# Altium project PCB_Project.PrjPcb
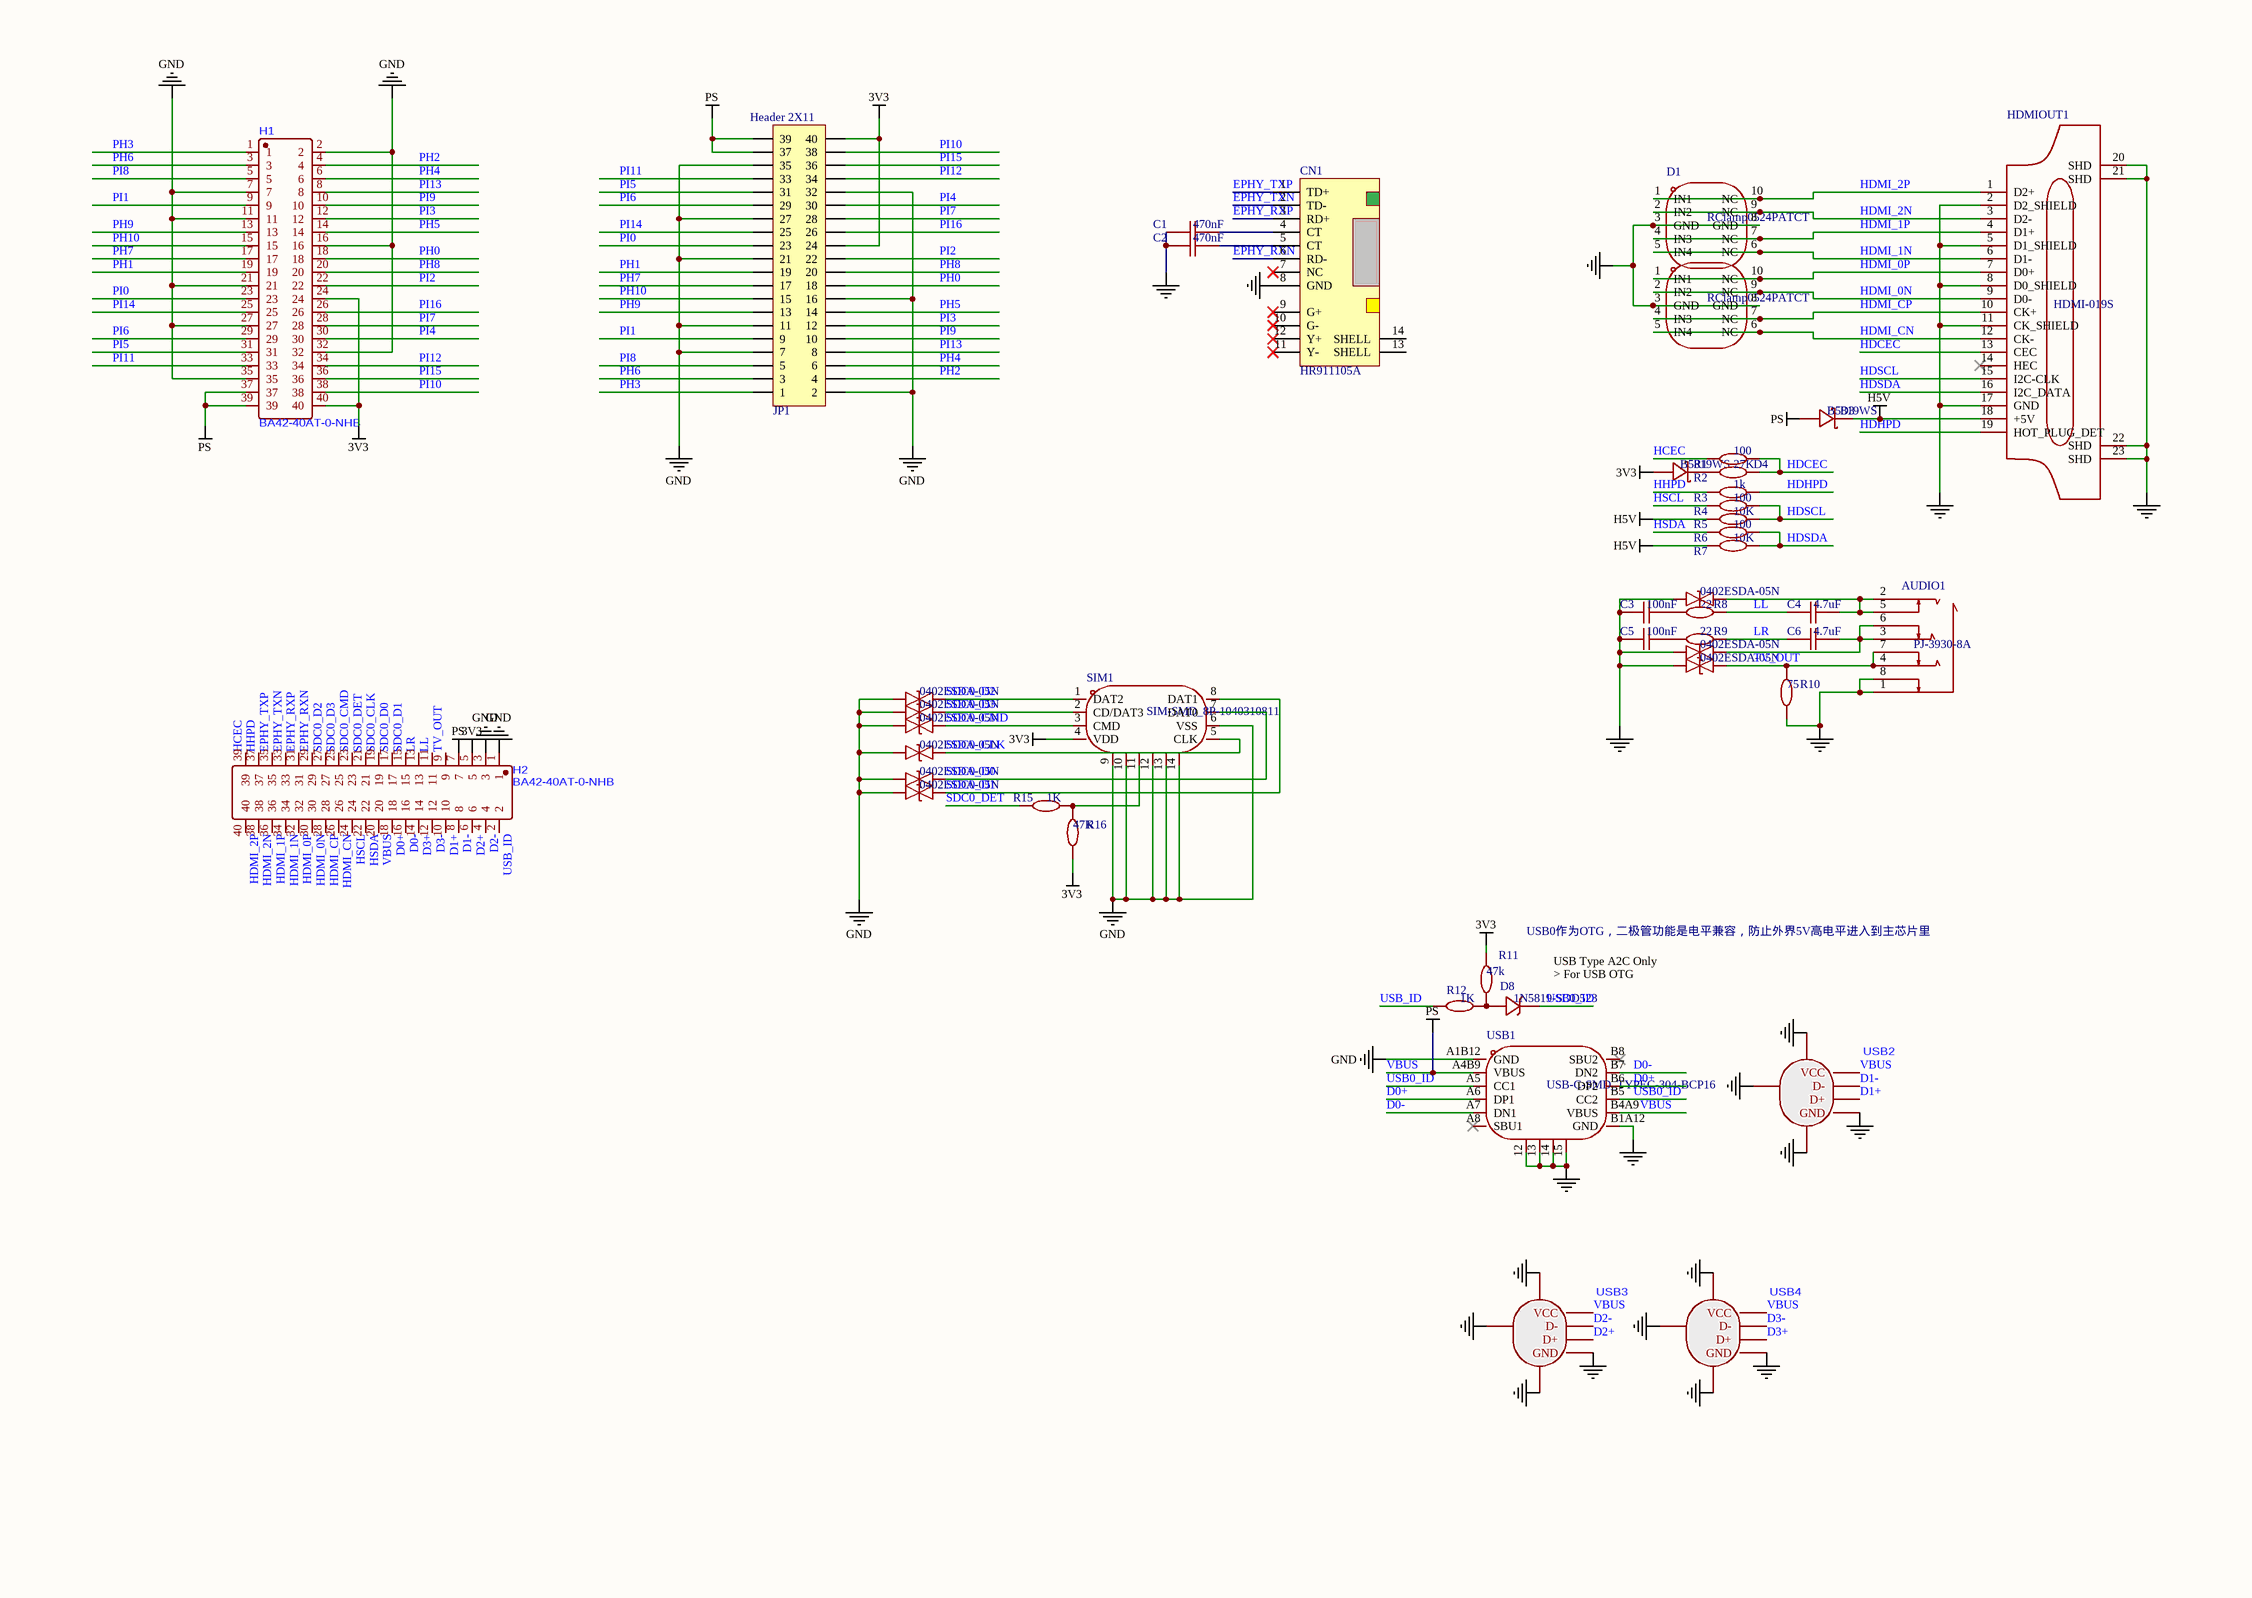
[diagram p0: base_board.schdoc]
1 sheet, 45 parts. Net scope: global (net labels, ports and power ports of the same name join across sheets).
Board file: PCB.pcbdoc

## Sheet base_board.schdoc
size 426 x 302 mm; Symbol: Sheet_A3; Device: Sheet_A3; @Project Name: Yuzuki Chameleon 基于H616的卡片电脑; REV: 1.0; Date: 2022-03-08; Sheet: 1/1; Draw By: GloomyGhost; Company: Your Company; @Update Date: 2025-03-02; @Page Count: 4; @Page No: 3; SheetNumber: 1; SheetTotal: 1

### Parts
AUDIO1  PJ-3930-8A  [AUDIO-TH_PJ-3930-8A]
C1  470nF  [C0402]
C2  470nF  [C0402]
C3  100nF  [C0402]
C4  4.7uF  [C0402]
C5  100nF  [C0402]
C6  4.7uF  [C0402]
CN1  HR911105A  [RJ8-HR911105A]
D1  RClamp0524PATCT  [SLP2510P8_L2.5-W1.0-P0.50-BL]
D2  RClamp0524PATCT  [SLP2510P8_L2.5-W1.0-P0.50-BL]
D3  B5819WS  [SOD-323_L1.8-W1.3-LS2.5-NSK]
D4  B5819WS  [SOD-323_L1.8-W1.3-LS2.5-NSK]
D5  0402ESDA-05N  [D0402]
D6  0402ESDA-05N  [D0402]
D7  0402ESDA-05N  [D0402]
D8  1N5819-SOD523  [SOD-523_L1.2-W0.8-LS1.6-FD]
D9  0402ESDA-05N  [D0402]
D10  0402ESDA-05N  [D0402]
D11  0402ESDA-05N  [D0402]
D12  0402ESDA-05N  [D0402]
D13  0402ESDA-05N  [D0402]
D14  0402ESDA-05N  [D0402]
H1  BA42-40AT-0-NHB  [CONN-SMD_40P-P0.80_10144517-042802LF]
H2  BA42-40AT-0-NHB  [CONN-SMD_40P-P0.80_10144517-042802LF]
HDMIOUT1  HDMI-019S  [HDMI-SMD_HDMI-019S]
JP1  Header 2X11  [HDR2.54-LI-2x20P]
R1  100  [R0402-NSK_2]
R2  27K  [R0402-NSK_2]
R3  1k  [R0402-NSK_2]
R4  100  [R0402-NSK_2]
R5  10K  [R0402-NSK_2]
R6  100  [R0402-NSK_2]
R7  10K  [R0402-NSK_2]
R8  22  [R0402-NSK_2]
R9  22  [R0402-NSK_2]
R10  75  [R0402-NSK_2]
R11  47k  [R0402-NSK_2]
R12  1K  [R0402-NSK_2]
R15  1K  [R0402-NSK_2]
R16  47K  [R0402-NSK_2]
SIM1  SIM-SMD_8P-1040310811  [SIM-SMD_8P-1040310811]
USB1  USB-C-SMD_TYPEC-304-BCP16  [USB-C-SMD_TYPEC-304-BCP16-1]
USB2  (no value)  [USB-A-TH_4P-P1.40-V-F-C39416]
USB3  (no value)  [USB-A-TH_4P-P1.40-V-F-C39416]
USB4  (no value)  [USB-A-TH_4P-P1.40-V-F-C39416]

### Nets
3V3: D4.2(A) H1.24 H1.40 H2.5 JP1.24 JP1.40 R11.2 R16.1 SIM1.4(VDD)
GND: AUDIO1.1 AUDIO1.8 C1.1 C2.1 C3.1 C5.1 CN1.8(GND) D1.3(GND) D1.8(GND) D2.3(GND) D2.8(GND) D5.1 D6.1 D7.1 D9.1 D10.1 D11.1 D12.1 D13.1 D14.1 H1.2 H1.7 H1.11 H1.16 H1.21 H1.27 H1.32 H1.35 H2.1 H2.3 HDMIOUT1.2(D2_SHIELD) HDMIOUT1.5(D1_SHIELD) HDMIOUT1.8(D0_SHIELD) HDMIOUT1.11(CK_SHIELD) HDMIOUT1.17(GND) HDMIOUT1.20(SHD) HDMIOUT1.21(SHD) HDMIOUT1.22(SHD) HDMIOUT1.23(SHD) JP1.2 JP1.7 JP1.11 JP1.16 JP1.21 JP1.27 JP1.32 JP1.35 R10.1 SIM1.6(VSS) SIM1.9 SIM1.10 SIM1.12 SIM1.13 SIM1.14 USB1.12 USB1.13 USB1.14 USB1.15 USB1.A1B12(GND) USB1.B1A12(GND) USB2.4(GND) USB2.5 USB2.6 USB2.7 USB3.4(GND) USB3.5 USB3.6 USB3.7 USB4.4(GND) USB4.5 USB4.6 USB4.7
H5V: D3.1(K) HDMIOUT1.18(+5V) R5.1 R7.1
VBUS: D3.2(A) H1.37 H1.39 H2.7 H2.20 JP1.37 JP1.39 USB1.A4B9(VBUS) USB1.B4A9(VBUS) USB2.1(VCC) USB3.1(VCC) USB4.1(VCC)  [also labelled PS]
D0+: H2.18 USB1.A6(DP1) USB1.B6(DP2)
D0-: H2.16 USB1.A7(DN1) USB1.B7(DN2)
D1+: H2.10 USB2.3(D+)
D1-: H2.8 USB2.2(D-)
D2+: H2.6 USB3.3(D+)
D2-: H2.4 USB3.2(D-)
D3+: H2.14 USB4.3(D+)
D3-: H2.12 USB4.2(D-)
EPHY_RXN: CN1.6(RD-) H2.29
EPHY_RXP: CN1.3(RD+) H2.31
EPHY_TXN: CN1.2(TD-) H2.33
EPHY_TXP: CN1.1(TD+) H2.35
HCEC: H2.39 R1.1
HDCEC: HDMIOUT1.13(CEC) R1.2 R2.2
HDHPD: HDMIOUT1.19(HOT_PLUG_DET) R3.2
HDMI_0N: D2.2(IN2) D2.9(NC) H2.30 HDMIOUT1.9(D0-)
HDMI_0P: D2.1(IN1) D2.10(NC) H2.32 HDMIOUT1.7(D0+)
HDMI_1N: D1.5(IN4) D1.6(NC) H2.34 HDMIOUT1.6(D1-)
HDMI_1P: D1.4(IN3) D1.7(NC) H2.36 HDMIOUT1.4(D1+)
HDMI_2N: D1.2(IN2) D1.9(NC) H2.38 HDMIOUT1.3(D2-)
HDMI_2P: D1.1(IN1) D1.10(NC) H2.40 HDMIOUT1.1(D2+)
HDMI_CN: D2.5(IN4) D2.6(NC) H2.26 HDMIOUT1.12(CK-)
HDMI_CP: D2.4(IN3) D2.7(NC) H2.28 HDMIOUT1.10(CK+)
HDSCL: HDMIOUT1.15(I2C-CLK) R4.2 R5.2
HDSDA: HDMIOUT1.16(I2C_DATA) R6.2 R7.2
HHPD: H2.37 R3.1
HSCL: H2.24 R4.1
HSDA: H2.22 R6.1
LL: C4.1 H2.11 R8.2
LR: C6.1 H2.13 R9.2
PH0: H1.18 JP1.18
PH1: H1.19 JP1.19
PH2: H1.4 JP1.4
PH3: H1.1 JP1.1
PH4: H1.6 JP1.6
PH5: H1.14 JP1.14
PH6: H1.3 JP1.3
PH7: H1.17 JP1.17
PH8: H1.20 JP1.20
PH9: H1.13 JP1.13
PH10: H1.15 JP1.15
PI0: H1.23 JP1.23
PI1: H1.9 JP1.9
PI2: H1.22 JP1.22
PI3: H1.12 JP1.12
PI4: H1.30 JP1.30
PI5: H1.31 JP1.31
PI6: H1.29 JP1.29
PI7: H1.28 JP1.28
PI8: H1.5 JP1.5
PI9: H1.10 JP1.10
PI10: H1.38 JP1.38
PI11: H1.33 JP1.33
PI12: H1.34 JP1.34
PI13: H1.8 JP1.8
PI14: H1.25 JP1.25
PI15: H1.36 JP1.36
PI16: H1.26 JP1.26
SDC0_CLK: D12.2 H2.19 SIM1.5(CLK)
SDC0_CMD: D11.2 H2.23 SIM1.3(CMD)
SDC0_D0: D13.2 H2.17 SIM1.7(DAT0)
SDC0_D1: D14.2 H2.15 SIM1.8(DAT1)
SDC0_D2: D9.2 H2.27 SIM1.1(DAT2)
SDC0_D3: D10.2 H2.25 SIM1.2(CD/DAT3)
SDC0_DET: H2.21 R15.1
TV_OUT: AUDIO1.4 AUDIO1.7 D7.2 H2.9 R10.2
USB0_ID: D8.2(K) USB1.A5(CC1) USB1.B5(CC2)
USB_ID: H2.2 R12.1
NetAUDIO1_2: AUDIO1.2 AUDIO1.5 C4.2 D5.2
NetAUDIO1_3: AUDIO1.3 AUDIO1.6 C6.2 D6.2
NetC1_2: C1.2 CN1.4(CT)
NetC2_2: C2.2 CN1.5(CT)
NetC3_2: C3.2 R8.1
NetC5_2: C5.2 R9.1
NetD4_1: D4.1(K) R2.1
NetD8_1: D8.1(A) R11.1 R12.2
NetR15_2: R15.2 R16.2 SIM1.11

Not connected (* = marked no-connect by the designer): CN1 7(NC)* 9(G+)* 10(G-)* 11(Y-)* 12(Y+)* 13(SHELL) 14(SHELL); HDMIOUT1 14(HEC)*; USB1 A8(SBU1)* B8(SBU2)*

### Notes on the sheet
- USB0作为OTG，二极管功能是电平兼容，防止外界5V高电平进入到主芯片里
- (near USB1) USB Type A2C Only
  > For USB OTG
- 1
- 2
- 3
- 4
- 5
- 6
- 7
- 8
- A
- B
- C
- D
- E
- TITLE:
- Yuzuki Chameleon 基于H616的卡片电脑
- REV:
- 1.0
- Date:
- Company:
- 2022-03-08
- Your Company
- Drawn By:
- GloomyGhost
- Sheet:
- 1/1

### Library data of the parts
C1-C6 = CAP_0402
CN1 = HR911105A: 带灯以太网接口
JP1 = Header 20X2: 20*2P接插件
R1-R12 R15 R16 = Res_0402
SIM1 = 1040310811
USB1 = TYPEC-304-BCP16
USB2-USB4 = AFSide of the three straight feet boundless copper14.0PBTWhite plastic90degree